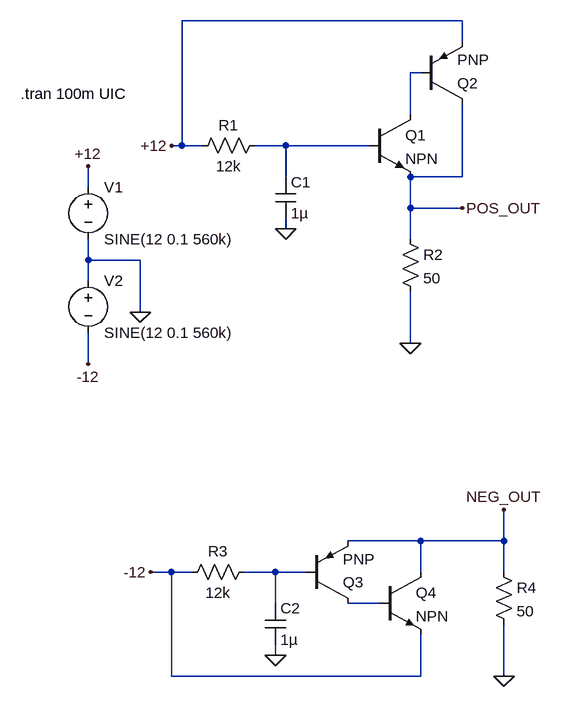
[diagram p0: schematic CapMultiplierSim.asc]
CapMultiplierSim.asc, the LTspice schematic file:
Version 4
SHEET 1 2852 3692
WIRE 640 0 208 0
WIRE 640 32 640 0
WIRE 576 80 560 80
WIRE 560 144 560 80
WIRE 208 192 208 0
WIRE 208 192 192 192
WIRE 240 192 208 192
WIRE 368 192 320 192
WIRE 496 192 368 192
WIRE 368 240 368 192
WIRE 640 240 640 128
WIRE 640 240 560 240
WIRE 64 256 64 224
WIRE 560 288 560 240
WIRE 640 288 560 288
WIRE 368 320 368 304
WIRE 560 336 560 288
WIRE 64 368 64 336
WIRE 144 368 64 368
WIRE 64 400 64 368
WIRE 144 448 144 368
WIRE 560 496 560 416
WIRE 64 528 64 480
WIRE 576 800 464 800
WIRE 704 800 704 752
WIRE 704 800 576 800
WIRE 192 848 160 848
WIRE 224 848 192 848
WIRE 352 848 304 848
WIRE 400 848 352 848
WIRE 576 848 576 800
WIRE 704 848 704 800
WIRE 352 896 352 848
WIRE 512 896 464 896
WIRE 352 976 352 960
WIRE 192 1008 192 848
WIRE 576 1008 576 944
WIRE 576 1008 192 1008
WIRE 704 1008 704 928
FLAG 64 224 +12
FLAG 64 528 -12
FLAG 144 448 0
FLAG 368 320 0
FLAG 192 192 +12
FLAG 560 496 0
FLAG 640 288 POS_OUT
FLAG 352 976 0
FLAG 160 848 -12
FLAG 704 1008 0
FLAG 704 752 NEG_OUT
SYMBOL voltage 64 240 R0
SYMATTR InstName V1
SYMATTR Value SINE(12 0.1 560k)
SYMBOL res 336 176 R90
WINDOW 0 0 56 VBottom 2
WINDOW 3 32 56 VTop 2
SYMATTR InstName R1
SYMATTR Value 12k
SYMBOL cap 352 240 R0
SYMATTR InstName C1
SYMATTR Value 1µ
SYMBOL voltage 64 384 R0
SYMATTR InstName V2
SYMATTR Value SINE(12 0.1 560k)
SYMBOL res 544 320 R0
SYMATTR InstName R2
SYMATTR Value 50
SYMBOL npn 496 144 R0
SYMATTR InstName Q1
SYMBOL pnp 576 128 M180
SYMATTR InstName Q2
SYMBOL res 320 832 R90
WINDOW 0 0 56 VBottom 2
WINDOW 3 32 56 VTop 2
SYMATTR InstName R3
SYMATTR Value 12k
SYMBOL cap 336 896 R0
SYMATTR InstName C2
SYMATTR Value 1µ
SYMBOL pnp 400 896 M180
SYMATTR InstName Q3
SYMBOL npn 512 848 R0
SYMATTR InstName Q4
SYMBOL res 688 832 R0
SYMATTR InstName R4
SYMATTR Value 50
TEXT -40 112 Left 2 !.tran 100m UIC

The netlist it stands for:
* CapMultiplierSim.asc
V1 +12 0 SINE(12 0.1 560k)
R1 N002 +12 12k
C1 N002 0 1µ
V2 0 -12 SINE(12 0.1 560k)
R2 POS_OUT 0 50
Q1 N001 N002 POS_OUT 0 NPN
Q2 POS_OUT N001 +12 0 PNP
R3 N003 -12 12k
C2 N003 0 1µ
Q3 N004 N003 NEG_OUT 0 PNP
Q4 NEG_OUT N004 -12 0 NPN
R4 NEG_OUT 0 50
.model NPN NPN
.model PNP PNP
.lib standard.bjt
.tran 100m UIC
.backanno
.end